# Altium schematic sheet xmos.SchDoc
size A4; DocumentNumber: 1; SheetNumber: 1; SheetTotal: 3
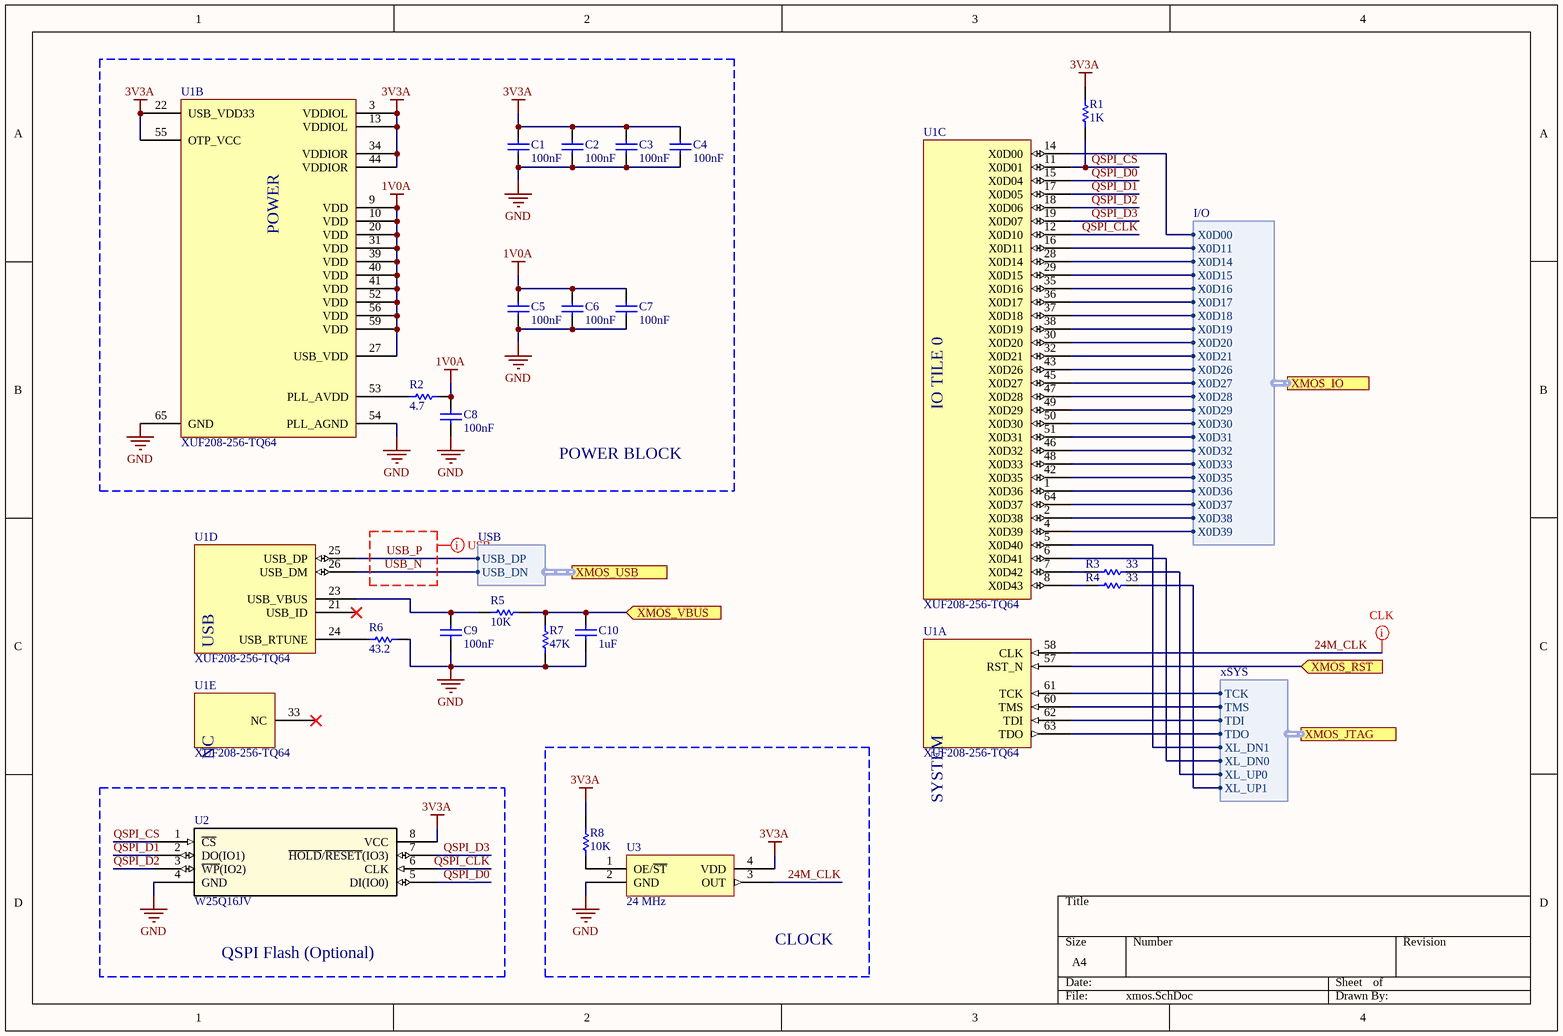
[diagram p0: xmos.SchDoc]

## Parts
C1  value 100nF  [CAP_0603]  (hidden comment: MLCC)
C2  value 100nF  [CAP_0603]  (hidden comment: MLCC)
C3  value 100nF  [CAP_0603]  (hidden comment: MLCC)
C4  value 100nF  [CAP_0603]  (hidden comment: MLCC)
C5  value 100nF  [CAP_0603]  (hidden comment: MLCC)
C6  value 100nF  [CAP_0603]  (hidden comment: MLCC)
C7  value 100nF  [CAP_0603]  (hidden comment: MLCC)
C8  value 100nF  [CAP_0603]  (hidden comment: MLCC)
C9  value 100nF  [CAP_0603]  (hidden comment: MLCC)
C10  value 1uF  [CAP_0603]  (hidden comment: MLCC)
R1  value 1K  [RC0603N]  (hidden comment: RES)
R2  value 4.7  [RC0603N]  (hidden comment: RES)
R3  value 33  [RC0603N]  (hidden comment: RES)
R4  value 33  [RC0603N]  (hidden comment: RES)
R5  value 10K  [RC0603N]  (hidden comment: RES)
R6  value 43.2  [RC0603N]  (hidden comment: RES)
R7  value 47K  [RC0603N]  (hidden comment: RES)
R8  value 10K  [RC0603N]  (hidden comment: RES)
U1  XUF208-256-TQ64  [TQ64]  (parts A,B,C,D,E of 5)
U2  W25Q16JV  [SOIC-8_150MIL]
U3  Frequency: 24 MHz  [QFN_3225_4P]  (hidden comment: XO)

## Blocks framed on the sheet
POWER BLOCK: C1-C8 R2 U1
CLOCK: R8 U3
QSPI Flash (Optional): U2

## Ports
XMOS_IO (harness I/O), XMOS_JTAG (harness xSYS), XMOS_RST (in), XMOS_USB (harness USB), XMOS_VBUS (in)

## Harnesses
xSYS: TCK, TMS, TDI, TDO, XL_DN1, XL_DN0, XL_UP0, XL_UP1
I/O: X0D00, X0D11, X0D14, X0D15, X0D16, X0D17, X0D18, X0D19, X0D20, X0D21, X0D26, X0D27, X0D28, X0D29, X0D30, X0D31, X0D32, X0D33, X0D35, X0D36, X0D37, X0D38, X0D39
USB: USB_DP, USB_DN

## Nets
1V0A: C5.2 C6.2 C7.2 C8.2 R2.2 U1.9(VDD) U1.10(VDD) U1.20(VDD) U1.27(USB_VDD) U1.31(VDD) U1.39(VDD) U1.40(VDD) U1.41(VDD) U1.52(VDD) U1.56(VDD) U1.59(VDD)
3V3A: C1.2 C2.2 C3.2 C4.2 R1.2 R8.2 U1.3(VDDIOL) U1.13(VDDIOL) U1.22(USB_VDD33) U1.34(VDDIOR) U1.44(VDDIOR) U1.55(OTP_VCC) U2.8(VCC) U3.4(VDD)
GND: C1.1 C2.1 C3.1 C4.1 C5.1 C6.1 C7.1 C8.1 C9.1 C10.2 R6.2 R7.1 U1.54(PLL_AGND) U1.65(GND) U2.4(GND) U3.2(GND)
24M_CLK: U1.58(CLK) U3.3(OUT)
QSPI_CLK: U1.12(X0D10) U2.6(CLK)
QSPI_CS: R1.1 U1.11(X0D01) U2.1(~{CS})
QSPI_D0: U1.15(X0D04) U2.5(DI(IO0))
QSPI_D1: U1.17(X0D05) U2.2(DO(IO1))
QSPI_D2: U1.18(X0D06) U2.3(~{WP}(IO2))
QSPI_D3: U1.19(X0D07) U2.7(~{HOLD}/~{RESET}(IO3))
USB_N: U1.26(USB_DM) ; port XMOS_USB.USB_DN
USB_P: U1.25(USB_DP) ; port XMOS_USB.USB_DP
XMOS_RST: U1.57(RST_N) ; port XMOS_RST
XMOS_VBUS: C10.1 R5.2 R7.2 ; port XMOS_VBUS
NetC9_2: C9.2 R5.1 U1.23(USB_VBUS)
NetR2_1: R2.1 U1.53(PLL_AVDD)
NetR3_1: R3.1 U1.7(X0D42)
NetR3_2: R3.2 ; port XMOS_JTAG.XL_UP0
NetR4_1: R4.1 U1.8(X0D43)
NetR4_2: R4.2 ; port XMOS_JTAG.XL_UP1
NetR6_1: R6.1 U1.24(USB_RTUNE)
NetR8_1: R8.1 U3.1(OE/~{ST})
NetU1_1: U1.1(X0D36) ; port XMOS_IO.X0D36
NetU1_2: U1.2(X0D38) ; port XMOS_IO.X0D38
NetU1_4: U1.4(X0D39) ; port XMOS_IO.X0D39
NetU1_5: U1.5(X0D40) ; port XMOS_JTAG.XL_DN1
NetU1_6: U1.6(X0D41) ; port XMOS_JTAG.XL_DN0
NetU1_14: U1.14(X0D00) ; port XMOS_IO.X0D00
NetU1_16: U1.16(X0D11) ; port XMOS_IO.X0D11
NetU1_28: U1.28(X0D14) ; port XMOS_IO.X0D14
NetU1_29: U1.29(X0D15) ; port XMOS_IO.X0D15
NetU1_30: U1.30(X0D20) ; port XMOS_IO.X0D20
NetU1_32: U1.32(X0D21) ; port XMOS_IO.X0D21
NetU1_35: U1.35(X0D16) ; port XMOS_IO.X0D16
NetU1_36: U1.36(X0D17) ; port XMOS_IO.X0D17
NetU1_37: U1.37(X0D18) ; port XMOS_IO.X0D18
NetU1_38: U1.38(X0D19) ; port XMOS_IO.X0D19
NetU1_42: U1.42(X0D35) ; port XMOS_IO.X0D35
NetU1_43: U1.43(X0D26) ; port XMOS_IO.X0D26
NetU1_45: U1.45(X0D27) ; port XMOS_IO.X0D27
NetU1_46: U1.46(X0D32) ; port XMOS_IO.X0D32
NetU1_47: U1.47(X0D28) ; port XMOS_IO.X0D28
NetU1_48: U1.48(X0D33) ; port XMOS_IO.X0D33
NetU1_49: U1.49(X0D29) ; port XMOS_IO.X0D29
NetU1_50: U1.50(X0D30) ; port XMOS_IO.X0D30
NetU1_51: U1.51(X0D31) ; port XMOS_IO.X0D31
NetU1_60: U1.60(TMS) ; port XMOS_JTAG.TMS
NetU1_61: U1.61(TCK) ; port XMOS_JTAG.TCK
NetU1_62: U1.62(TDI) ; port XMOS_JTAG.TDI
NetU1_63: U1.63(TDO) ; port XMOS_JTAG.TDO
NetU1_64: U1.64(X0D37) ; port XMOS_IO.X0D37

Not connected (* = marked no-connect by the designer): U1 21(USB_ID)* 33(NC)*

## Layout directives
differential pair; differential pair class USB_DIFFPAIR; net class USB; rule Differential Pairs Routing [Pref Gap = 5mil    Min Gap  = 5mil    Max Gap  = 30milPref Width = 8.1mil    Min Width  = 8.1mil    Max Width  = 8.1mil]: USB_N, USB_P
net class CLK; rule Width Constraint [Pref Width = 11.55mil    Min Width = 11mil    Max Width = 12mil]: 24M_CLK

## Notes on the sheet
- (in symbol XUF208-256-TQ64, part A) SYSTEM
- (in symbol XUF208-256-TQ64, part B) POWER
- (in symbol XUF208-256-TQ64, part C) IO TILE 0
- (in symbol XUF208-256-TQ64, part D) USB

## Library data of the parts
C1-C10 = MLCC: Multilayer Ceramic Capacitors; VoltageRatingDC: 5V; Tolerance: 10%
R1-R8 = RES: Chip Resistors; PowerRating: 0.25W
U1 = XUF208-256-TQ64: xCORE Multicore Microcontroller, xCORE-200, USB, Single Tile, 8 Cores, 500MHz, 64TQFP; Manufacturer: XMOS; Manufacturer Part Number: XUF208-256-TQ64; Value: XUF208-256-TQ64
U2 = W25Q16JV: 3V 16M-BIT SERIAL FLASH MEMORY WITH DUAL/QUAD SPI; Manufacturer_Part_Number: W25Q16JVXXXX; Vendor: Winbond; Built_By: EMA_Anthony; Copyright: Copyright (C) 2018 Accelerated Designs. All rights reserved; RefDes: RefDes; Type: DEV; Value: Value
U3 = XO: SiTime Ultra Performance Oscillator; Manufacturer: SiTime; ComponentLink1Description: Manufacturer URL; ComponentLink1URL: https://www.sitime.com; ComponentLink2Description: Datasheet; ComponentLink2URL: https://www.sitime.com/datasheet/SiT8208